# Altium schematic sheet Multivibrator.SchDoc
size A4
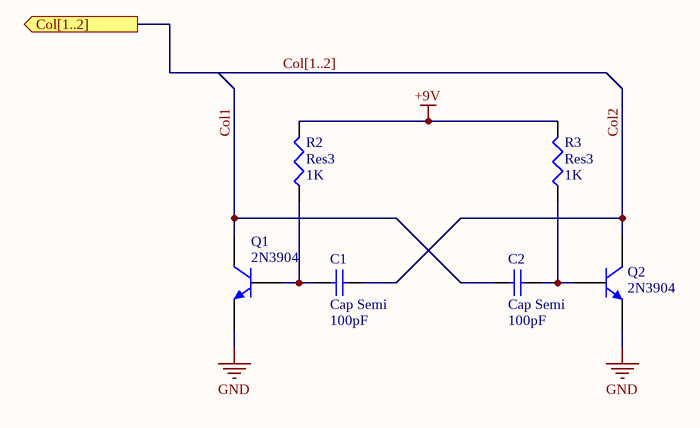
[diagram p0: Multivibrator.SchDoc]

## Parts
C1  Cap Semi  value 100pF  [C1206]
C2  Cap Semi  value 100pF  [C1206]
Q1  2N3904  [TO-92A]
Q2  2N3904  [TO-92A]
R2  Res3  value 1K  [J1-0603]
R3  Res3  value 1K  [J1-0603]

## Ports
Col[1..2] (out)

## Nets
+9V: R2.2 R3.2
GND: Q1.1(E) Q2.1(E)
Col1: C2.1 Q1.3(C)
Col2: C1.2 Q2.3(C)
NetC1_1: C1.1 Q1.2(B) R2.1
NetC2_2: C2.2 Q2.2(B) R3.1

## Buses and harness runs
bus Col[1..2] = port Col[1..2]

## Library data of the parts
C1 C2 = Cap Semi: Capacitor (Semiconductor SIM Model); Published: 8-Jun-2000; LatestRevisionDate: 29-May-2009; LatestRevisionNote: IPC-7351 Footprint Added.; PackageReference: C1206; Publisher: Altium Limited; PackageDescription: Chip Capacitor
Q1 Q2 = 2N3904: NPN General Purpose Amplifier; Published: 8-Jun-2000; LatestRevisionDate: 15-Jan-2003; LatestRevisionNote: PCB Footprint 'BCY-W3/D4.7' replaced; DatasheetVersion: 1997; PackageVersion: Sep-1998; PackageReference: TO-92A; Publisher: Altium Limited; PackageDescription: TO, Flat Index; 3 In-Line, Axial Leads; Body Dia. 4.5mm; Leads 0.51 x 0.48 mm (max); ComponentLink1Description: Manufacturer Link; ComponentLink1URL: http://www.fairchildsemi.com/; ComponentLink2Description: Datasheet; ComponentLink2URL: http://www.fairchildsemi.com/ds/2N%2F2N3904.pdf
R2 R3 = Res3: Resistor; Published: 8-Jun-2000; LatestRevisionDate: 29-May-2009; LatestRevisionNote: IPC-7351 Footprint Added.; PackageReference: J1-0603; Publisher: Altium Limited; PackageDescription: Chip Resistor